# EAGLE schematic redony (EAGLE 9.4.2)
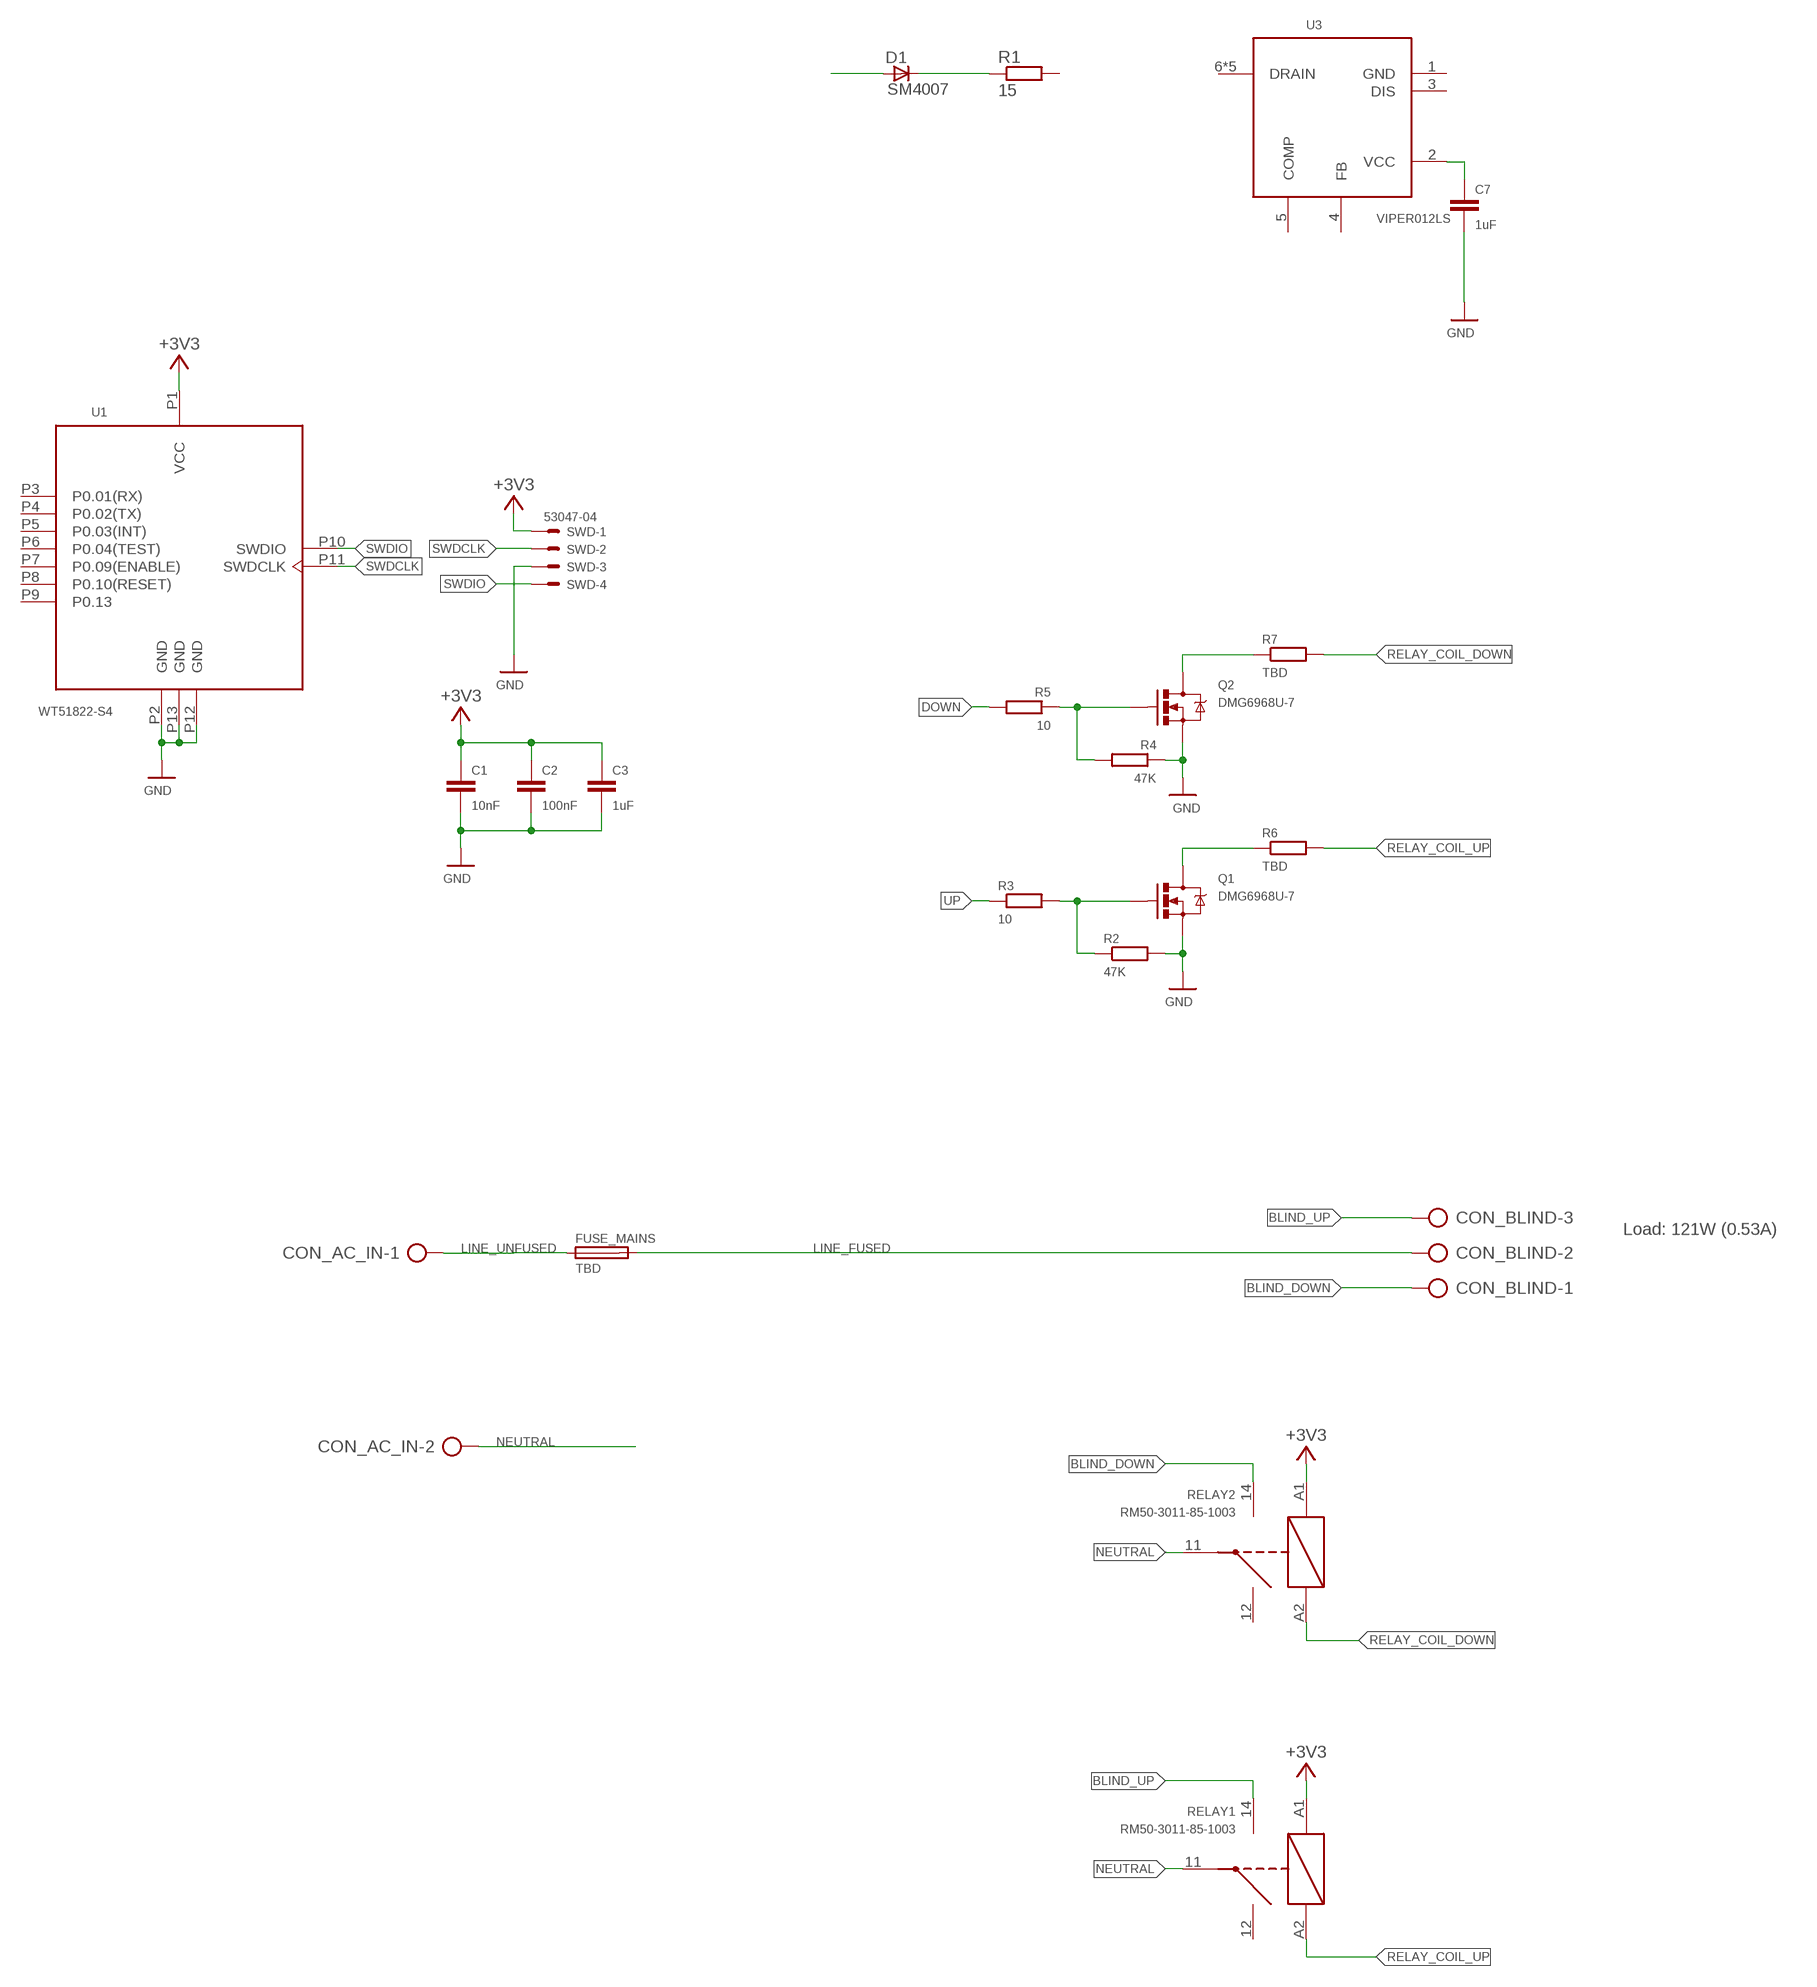
[diagram p0: schematic, sheet 1]

## Parts
C1  10nF  C-EUC0603  [C0603]
C2  100nF  C-EUC0603  [C0603]
C3  1uF  C-EUC0603  [C0603]
C7  1uF  C-EUC0603  [C0603]
CON_AC_IN  AK300/2  [AK300/2]
CON_BLIND  AK500/3  [AK500/3]
D1  SM4007  [MELF-MLL41_DO213AB]
FUSE_MAINS  TBD  SH22,5  [SH22,5]
Q1  DMG6968U-7  MOSFET-NCHANNELSMD  [SOT23-3]
Q2  DMG6968U-7  MOSFET-NCHANNELSMD  [SOT23-3]
R1  15  R-EU_M1206  [M1206]
R2  47K  R-EU_R0603  [R0603]
R3  10  R-EU_R0603  [R0603]
R4  47K  R-EU_R0603  [R0603]
R5  10  R-EU_R0603  [R0603]
R6  TBD  R-EU_R0603  [R0603]
R7  TBD  R-EU_R0603  [R0603]
RELAY1  RM50-3011-85-1003  RM50-3011-XX-XXXX  [RM50-3011-XX-XXXX]
RELAY2  RM50-3011-85-1003  RM50-3011-XX-XXXX  [RM50-3011-XX-XXXX]
SWD  53047-04  [53047-04]
U1  WT51822-S4  WT51822-S4ATMODULE  [WT51822-S4AT]
U3  VIPER012LS  [SOIC100P600X175-10N]

## Nets
+3V3: C1.1 C2.1 C3.1 RELAY1.A1 RELAY2.A1 SWD.1 U1.P1(VCC)
BLIND_DOWN: CON_BLIND.1 RELAY2.14
BLIND_UP: CON_BLIND.3 RELAY1.14
DOWN: R5.2
GND: C1.2 C2.2 C3.2 C7.2 Q1.2(S) Q2.2(S) R2.2 R4.1 SWD.3 U1.P2(GND) U1.P12(GND) U1.P13(GND)
LINE_FUSED: CON_BLIND.2 FUSE_MAINS.2
LINE_UNFUSED: CON_AC_IN.1 FUSE_MAINS.1
MOTOR_A_GATE_R: Q1.1(G) R2.1 R3.2
MOTOR_B_GATE_R: Q2.1(G) R4.2 R5.1
N$2: C7.1 U3.2(VCC)
N$4: D1.A
N$5: D1.C R1.1
NEUTRAL: CON_AC_IN.2 RELAY1.11 RELAY2.11
RELAY_COIL_DOWN: R7.2 RELAY2.A2
RELAY_COIL_DOWN__R: Q2.3(D) R7.1
RELAY_COIL_UP: R6.2 RELAY1.A2
RELAY_COIL_UP__R: Q1.3(D) R6.1
SWDCLK: SWD.2 U1.P11(SWDCLK)
SWDIO: SWD.4 U1.P10(SWDIO)
UP: R3.1
Unconnected: R1.2 RELAY1.12 RELAY2.12 U1.P3(P0.01(RX)) U1.P4(P0.02(TX)) U1.P5(P0.03(INT)) U1.P6(P0.04(TEST)) U1.P7(P0.09(ENABLE)) U1.P8(P0.10(RESET)) U1.P9(P0.13) U3.1(GND) U3.3(DIS) U3.4(FB) U3.5(COMP) U3.6(DRAIN) U3.7(DRAIN) U3.8(DRAIN) U3.9(DRAIN) U3.10(DRAIN)

## Notes on the sheet
- Load: 121W (0.53A)

## Library data of the parts
C1-C3 C7 = rcl:C-EU: CAPACITOR, European symbol
CON_AC_IN = con-ptr500:AK300/2: CONNECTOR; OC_FARNELL: unknown; OC_NEWARK: unknown
CON_BLIND = con-ptr500:AK500/3: CONNECTOR; OC_FARNELL: unknown; OC_NEWARK: unknown
D1 = _hhn_diodes_smd:SM400*: SM4001 .. SM4007 General Purpose Rectifier, 1 A SMD-Version of 1N4001 .. 1N4007 Case: MELF-MLL41 = DO 213 AB Author: Dipl.-Ing. FH Rainer Bayer HHN Hochschule Heilbronn, rainer.bayer@hs-heilbronn.de Ingenieurbüro ing-rb, mail@ing-rb.de
FUSE_MAINS = fuse:SH22,5: FUSE HOLDER grid 22,5 mm, OGN0031 8201, Schurter (Buerklin); MF: SCHURTER; MPN: 0031.8201; OC_RET: 51-01-42
Q1 Q2 = SparkFun:MOSFET-NCHANNEL
R1-R7 = rcl:R-EU_: RESISTOR, European symbol
RELAY1 RELAY2 = relay-relpol:RM50-3011-XX-XXXX: RM50-3011-XX-XXXX (1CO) miniature relays from relpol S.A. <http://www.relpol.pl> (C) 2014 Tomasz Boleslaw CEDRO, cederom@tlen.pl, http://www.tomek.cedro.info. Version 0.1 (2014-01-12): Initial release.
SWD = con-molex:53?-04: CONNECTOR wire to board 1.25 mm (.049 inch) pitch header; MF: WALDOM/MOLEX; MPN: 53047-0410; OC_FARNELL: 9733060; OC_NEWARK: 38C9900
U1 = martonmiklos:WT51822-S4AT: WT51822-S4AT is a high performance, low power radio transmit and receive system module use Nordic BLE 4.1 nRF51822 as the controller chips.
U3 = st_viper:VIPER012LS; OC_TME: VIPER012LS